# Altium schematic sheet 2502_IDS_TransMax_PWM_Digital.SchDoc
size A4; SheetNumber: 2; SheetTotal: 2
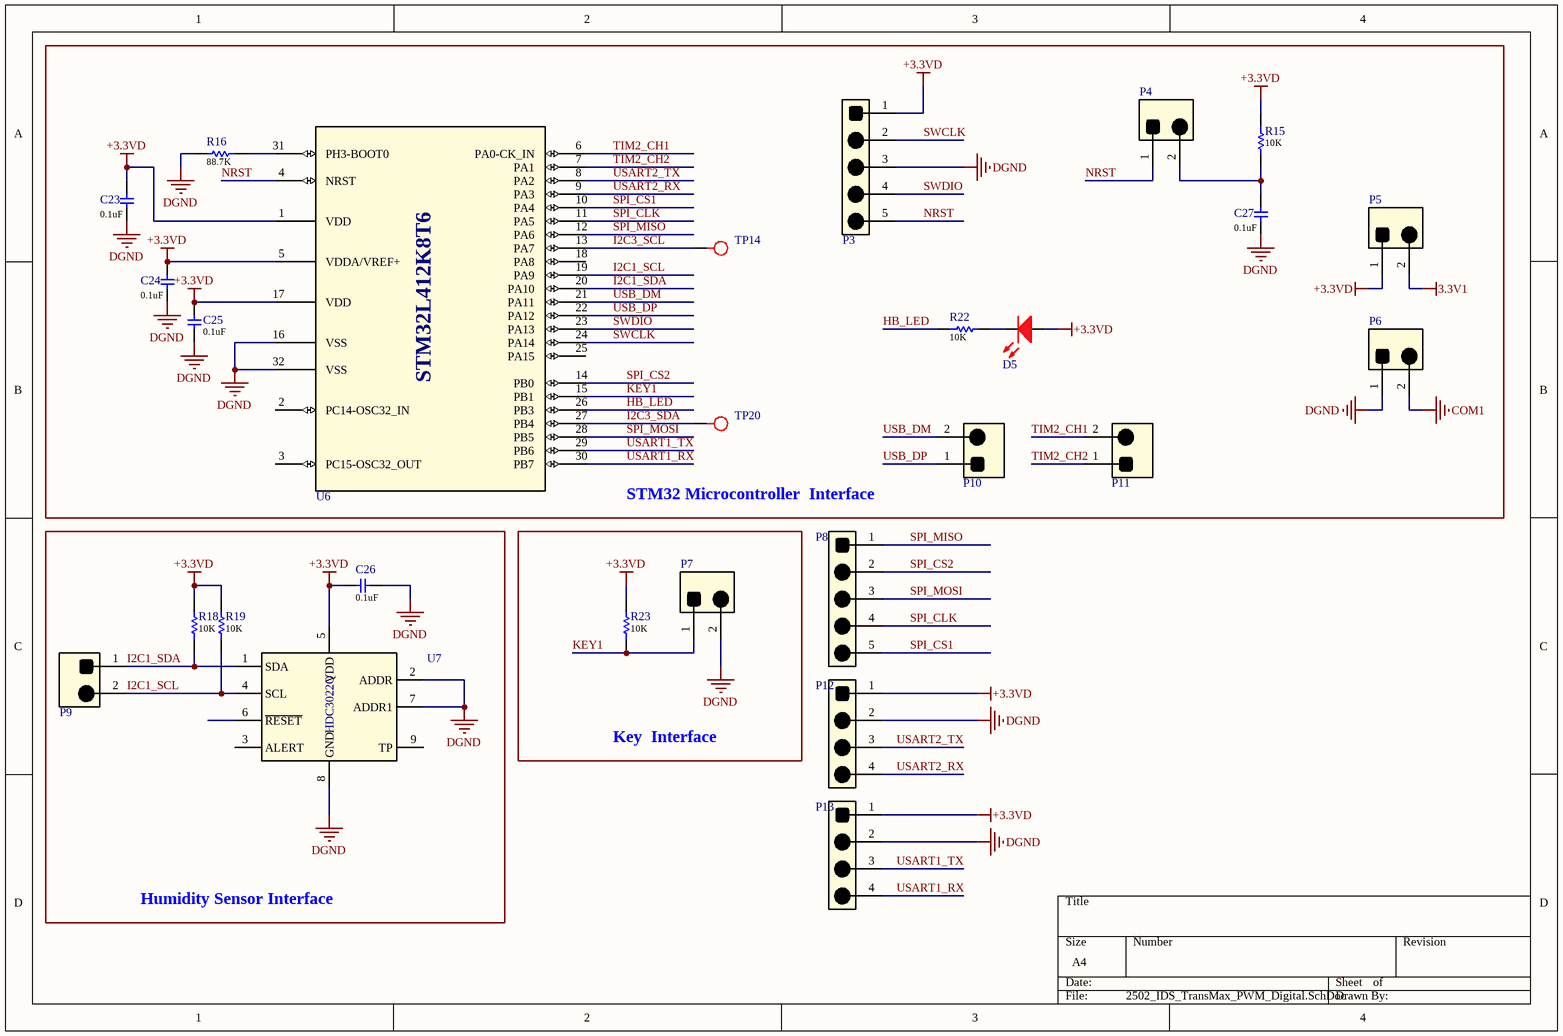
[diagram p0: 2502_IDS_TransMax_PWM_Digital.SchDoc]

## Parts
C23  value 0.1uF  [C_0603 (1608 Metric)]  (hidden comment: CAP CER 0.1UF 100V X7R 0603)
C24  value 0.1uF  [C_0603 (1608 Metric)]  (hidden comment: CAP CER 0.1UF 100V X7R 0603)
C25  value 0.1uF  [C_0603 (1608 Metric)]  (hidden comment: CAP CER 0.1UF 100V X7R 0603)
C26  value 0.1uF  [C_0603 (1608 Metric)]  (hidden comment: CAP CER 0.1UF 100V X7R 0603)
C27  value 0.1uF  [C_0603 (1608 Metric)]  (hidden comment: CAP CER 0.1UF 100V X7R 0603)
D5  LED RED CLEAR 0805 SMD  [L_SMD0805]  (value not drawn)
P3  CONN HEADER VERT 5POS 2.54MM  [61300511121]  (value not drawn)
P4  CONN HEADER VERT 2POS 2.54MM  [61300211121]  (value not drawn)
P5  CONN HEADER VERT 2POS 2.54MM  [61300211121]  (value not drawn)
P6  CONN HEADER VERT 2POS 2.54MM  [61300211121]  (value not drawn)
P7  CONN HEADER VERT 2POS 2.54MM  [61300211121]  (value not drawn)
P8  CONN HEADER VERT 5POS 2.54MM  [61300511121]  (value not drawn)
P9  CONN HEADER VERT 2POS 2.54MM  [61300211121]  (value not drawn)
P10  CONN HEADER VERT 2POS 2.54MM  [61300211121]  (value not drawn)
P11  CONN HEADER VERT 2POS 2.54MM  [61300211121]  (value not drawn)
P12  CONN HEADER VERT 4POS 2.54MM  [61300411121]  (value not drawn)
P13  CONN HEADER VERT 4POS 2.54MM  [61300411121]  (value not drawn)
R15  value 10K  [0603 (1608 Metric)]  (hidden comment: RES 10K OHM 1% 1/10W 0603)
R16  value 88.7K  [0805 (2012 Metric)]  (hidden comment: RES 88.7K OHM 1% 1/8W 0805)
R18  value 10K  [0603 (1608 Metric)]  (hidden comment: RES 10K OHM 1% 1/10W 0603)
R19  value 10K  [0603 (1608 Metric)]  (hidden comment: RES 10K OHM 1% 1/10W 0603)
R22  value 10K  [0603 (1608 Metric)]  (hidden comment: RES 10K OHM 1% 1/10W 0603)
R23  value 10K  [0603 (1608 Metric)]  (hidden comment: RES 10K OHM 1% 1/10W 0603)
TP14  Test Point  [Testpoint PTH]  (value not drawn)
TP20  Test Point  [Testpoint PTH]  (value not drawn)
U6  IC STM32L412K8T6 32-LQFP  [32-LQFP]  (value not drawn)
U7  RH DIGITAL HUMIDITY SENSOR  [8-LFDFN Exposed Pad]  (value not drawn)

## Blocks framed on the sheet
STM32 Microcontroller  Interface: C23-C25 C27 D5 P3-P6 P10 P11 R15 R16 R22 TP14 TP20 U6
Humidity Sensor Interface: C26 P9 R18 R19 U7
Key  Interface: P7 R23

## Nets
3.3V1: P5.2
+3.3VD: C23.2 C24.2 C25.2 C26.2 D5.1(A) P3.1 P5.1 P12.1 P13.1 R15.2 R18.1 R19.1 R23.1 U6.1(VDD) U6.5(VDDA/VREF+) U6.17(VDD) U7.5(VDD)
COM1: P6.2
DGND: C23.1 C24.1 C25.1 C26.1 C27.1 P3.3 P6.1 P7.2 P12.2 P13.2 R16.1 U6.16(VSS) U6.32(VSS) U7.2(ADDR) U7.7(ADDR1) U7.8(GND)
HB_LED: R22.2 U6.26(PB3)
I2C1_SCL: P9.2 R19.2 U6.19(PA9) U7.4(SCL)
I2C1_SDA: P9.1 R18.2 U6.20(PA10) U7.1(SDA)
I2C3_SCL: TP14.1 U6.13(PA7)
I2C3_SDA: TP20.1 U6.27(PB4)
KEY1: P7.1 R23.2 U6.15(PB1)
NRST: P3.5 P4.1 U6.4(NRST)
SPI_CLK: P8.4 U6.11(PA5)
SPI_CS1: P8.5 U6.10(PA4)
SPI_CS2: P8.2 U6.14(PB0)
SPI_MISO: P8.1 U6.12(PA6)
SPI_MOSI: P8.3 U6.28(PB5)
SWCLK: P3.2 U6.24(PA14)
SWDIO: P3.4 U6.23(PA13)
TIM2_CH1: P11.2 U6.6(PA0-CK_IN)
TIM2_CH2: P11.1 U6.7(PA1)
USART1_RX: P13.4 U6.30(PB7)
USART1_TX: P13.3 U6.29(PB6)
USART2_RX: P12.4 U6.9(PA3)
USART2_TX: P12.3 U6.8(PA2)
USB_DM: P10.2 U6.21(PA11)
USB_DP: P10.1 U6.22(PA12)
NetC27_2: C27.2 P4.2 R15.1
NetD5_2: D5.2(K) R22.1
NetR16_2: R16.2 U6.31(PH3-BOOT0)

Not connected (* = marked no-connect by the designer): U6 2(PC14-OSC32_IN) 3(PC15-OSC32_OUT) 18(PA8) 25(PA15); U7 3(ALERT) 6(~{RESET}) 9(TP)

## Notes on the sheet
- (in symbol HDC3022QDEJRQ1) HDC3022Q

## Library data of the parts
C23-C27 = CAP CER 0.1UF 100V X7R 0603: Manufacturer Part Number: 0603B104K101CT; Manufacturer: Walsin Technology Corporation; Store ID: *; Price@100: $0.01000
D5 = LED RED CLEAR 0805 SMD: Manufacturer Part No: EAST2012RA2; Manufacturer Name: Everlight Electronics Co Ltd; Price@100: $0.06930
P3 P8 = CONN HEADER VERT 5POS 2.54MM: Manufacturer Name: Würth Elektronik; Value: 61300511121; Manufacturer Part No: 61300511121; Store ID: *; Price@100: $0.12690
P4-P7 P9-P11 = CONN HEADER VERT 2POS 2.54MM: Manufacturer Name: Würth Elektronik; Value: 61300211121; Manufacturer Part No: 61300211121; Store ID: *; Price@100: $0.06390
P12 P13 = CONN HEADER VERT 4POS 2.54MM: Manufacturer Name: Würth Elektronik; Value: 61300411121; Manufacturer Part No: 61300411121; Store ID: *; Price@100: $0.09180
R15 R18 R19 R22 R23 = RES 10K OHM 1% 1/10W 0603: Manufacturer Part No: RMCF0603FT10K0; Manufacturer Name: Stackpole Electronics Inc; Store ID: *; Price@100: $0.00910
R16 = RES 88.7K OHM 1% 1/8W 0805: Manufacturer Part No: RC0805FR-0788K7L; Manufacturer Name: YAGEO; Store ID: *; Price@100: $0.01020
U6 = STM32L412K8T6: Manufacturer Name: STMicroelectronics; Manufacturer Part No: STM32L412K8T6; Value: STM32L412K8T6; Price@100: $2.04950
U7 = HDC3022QDEJRQ1: Manufacturer Name: Texas Instruments; Manufacturer Part No: HDC3022QDEJRQ1; Store ID: *; Value: HDC3022QDEJRQ1; Price@100: $2.92650
TP14 TP20 = Test Point: Store ID: *; Price@100: $1.77